# EAGLE design rng_rava (EAGLE 9.6.2)
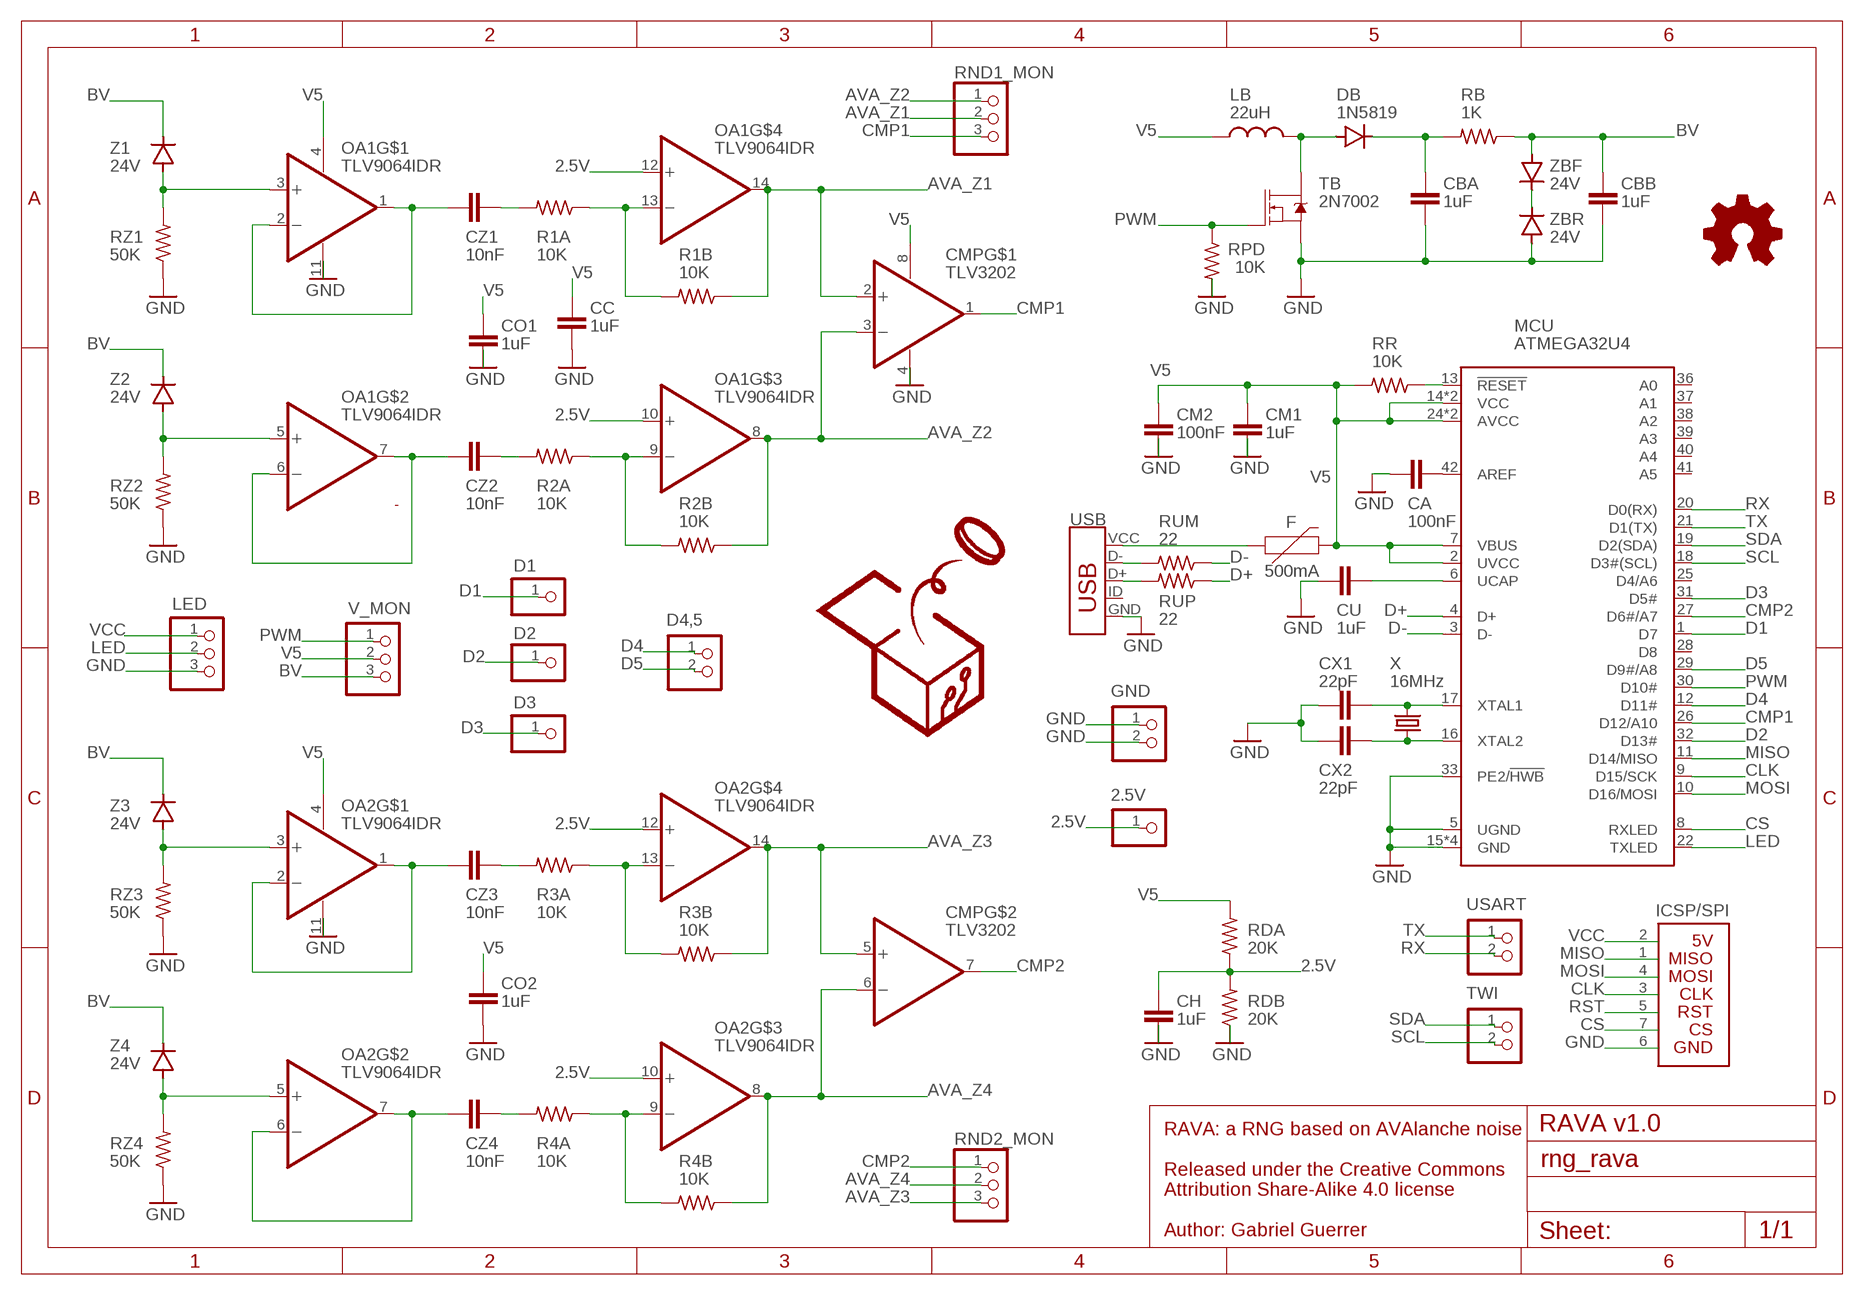
[diagram p0: schematic, sheet 1]

## Parts
2.5V  PINHD-1X1LARGE  [1X01LARGE]
CA  100nF  C_0805  [0805]
CBA  1uF  C_0805  [0805]
CBB  1uF  C_0805  [0805]
CC  1uF  C_0805  [0805]
CH  1uF  C_0805  [0805]
CM1  1uF  C_0805  [0805]
CM2  100nF  C_0805  [0805]
CMP  TLV3202  [SOIC8]
CO1  1uF  C_0805  [0805]
CO2  1uF  C_0805  [0805]
CU  1uF  C_0805  [0805]
CX1  22pF  C_0805  [0805]
CX2  22pF  C_0805  [0805]
CZ1  10nF  C_0805  [0805]
CZ2  10nF  C_0805  [0805]
CZ3  10nF  C_0805  [0805]
CZ4  10nF  C_0805  [0805]
D1  PINHD-1X1LARGE  [1X01LARGE]
D2  PINHD-1X1LARGE  [1X01LARGE]
D3  PINHD-1X1LARGE  [1X01LARGE]
D4,5  PINHD-1X2  [1X02]
DB  1N5819  DIODESOD-323  [SOD-323]
F  500mA  PPTC_6V500MA  [0805]
GND  PINHD-1X2  [1X02]
ICSP/SPI  ICSP-CS  [2X04]
LB  22uH  L_0805  [0805]
LED  PINHD-1X3  [1X03]
MCU  ATMEGA32U4  ATMEGA32U4-ARDUINOTQFP-44  [TQFP44]
OA1  TLV9064IDR  [SOIC127P600X175-14N]
OA2  TLV9064IDR  [SOIC127P600X175-14N]
R1A  10K  R_0805  [0805]
R1B  10K  R_0805  [0805]
R2A  10K  R_0805  [0805]
R2B  10K  R_0805  [0805]
R3A  10K  R_0805  [0805]
R3B  10K  R_0805  [0805]
R4A  10K  R_0805  [0805]
R4B  10K  R_0805  [0805]
RB  1K  R_0805  [0805]
RDA  20K  R_0805  [0805]
RDB  20K  R_0805  [0805]
RND1_MON  PINHD-1X3  [1X03]
RND2_MON  PINHD-1X3  [1X03]
RPD  10K  R_0805  [0805]
RR  10K  R_0805  [0805]
RUM  22  R_0805  [0805]
RUP  22  R_0805  [0805]
RZ1  50K  R_0805  [0805]
RZ2  50K  R_0805  [0805]
RZ3  50K  R_0805  [0805]
RZ4  50K  R_0805  [0805]
TB  2N7002  MOSFET-NCH-2N7002PW  [SOT323]
TWI  PINHD-1X2  [1X02]
USART  PINHD-1X2  [1X02]
USB  C40957  USB-MICROB-C40957U254-051N-4BH806  [U254-051N-4BH806]
V_MON  PINHD-1X3  [1X03]
X  16MHz  CRYSTAL_5032  [SMD_5032]
Z1  24V  DIODESOD-323  [SOD-323]
Z2  24V  DIODESOD-323  [SOD-323]
Z3  24V  DIODESOD-323  [SOD-323]
Z4  24V  DIODESOD-323  [SOD-323]
ZBF  24V  DIODESOD-323  [SOD-323]
ZBR  24V  DIODESOD-323  [SOD-323]

## Nets
2.5V: 2.5V.1 CH.2 OA1.10(+IN) OA1.12(+IN) OA2.10(+IN) OA2.12(+IN) RDA.1 RDB.2
AVA_Z1: CMP.2(+IN) OA1.14(OUT) R1B.1 RND1_MON.2
AVA_Z2: CMP.3(-IN) OA1.8(OUT) R2B.1 RND1_MON.1
AVA_Z3: CMP.5(+IN) OA2.14(OUT) R3B.1 RND2_MON.3
AVA_Z4: CMP.6(-IN) OA2.8(OUT) R4B.1 RND2_MON.2
BV: CBB.1 RB.1 V_MON.3 Z1.C Z2.C Z3.C Z4.C ZBF.A
CLK: ICSP/SPI.3(CLK) MCU.9(D15/SCK)
CMP1: CMP.1(OUT) MCU.26(D12/A10) RND1_MON.3
CMP2: CMP.7(OUT) MCU.27(D6#/A7) RND2_MON.1
CS: ICSP/SPI.7(CS) MCU.8(RXLED)
D1: D1.1 MCU.1(D7)
D2: D2.1 MCU.32(D13#)
D3: D3.1 MCU.31(D5#)
D4: D4,5.1 MCU.12(D11#)
D5: D4,5.2 MCU.29(D9#/A8)
D+: MCU.4(D+) RUP.1
D-: MCU.3(D-) RUM.1
GND: CA.1 CBA.2 CBB.2 CC.2 CH.1 CM1.1 CM2.1 CMP.4(GND) CO1.2 CO2.2 CU.1 CX1.2 CX2.2 GND.1 GND.2 ICSP/SPI.6(GND) LED.3 MCU.5(UGND) MCU.15(GND) MCU.23(GND) MCU.33(PE2/!HWB) MCU.35(GND) MCU.43(GND) OA1.11(GND) OA2.11(GND) RDB.1 RPD.2 RZ1.1 RZ2.1 RZ3.1 RZ4.1 TB.2(S) USB.GND ZBR.A
LED: LED.2 MCU.22(TXLED)
MISO: ICSP/SPI.1(MISO) MCU.11(D14/MISO)
MOSI: ICSP/SPI.4(MOSI) MCU.10(D16/MOSI)
N$1: CZ1.2 R1A.2
N$2: CZ1.1 OA1.1(OUT) OA1.2(-IN)
N$3: OA1.3(+IN) RZ1.2 Z1.A
N$4: OA1.13(-IN) R1A.1 R1B.2
N$5: CZ2.1 OA1.6(-IN) OA1.7(OUT)
N$6: OA1.5(+IN) RZ2.2 Z2.A
N$7: CZ2.2 R2A.2
N$8: OA1.9(-IN) R2A.1 R2B.2
N$9: CZ3.1 OA2.1(OUT) OA2.2(-IN)
N$10: OA2.3(+IN) RZ3.2 Z3.A
N$11: CZ3.2 R3A.2
N$12: OA2.13(-IN) R3A.1 R3B.2
N$13: CZ4.1 OA2.6(-IN) OA2.7(OUT)
N$14: OA2.5(+IN) RZ4.2 Z4.A
N$15: CZ4.2 R4A.2
N$16: OA2.9(-IN) R4A.1 R4B.2
N$17: DB.A LB.2 TB.3(D)
N$18: CBA.1 DB.C RB.2
N$19: ZBF.C ZBR.C
N$20: CU.2 MCU.6(UCAP)
N$21: RUM.2 USB.D-
N$22: RUP.2 USB.D+
N$23: CX1.1 MCU.17(XTAL1) X.P$2
N$24: CX2.1 MCU.16(XTAL2) X.P$1
N$25: CA.2 MCU.42(AREF)
PWM: MCU.30(D10#) RPD.1 TB.1(G) V_MON.1
RST: ICSP/SPI.5(RST) MCU.13(!RESET) RR.1
RX: MCU.20(D0(RX)) USART.2
SCL: MCU.18(D3#(SCL)) TWI.2
SDA: MCU.19(D2(SDA)) TWI.1
TX: MCU.21(D1(TX)) USART.1
V5: CC.1 CM1.2 CM2.2 CMP.8(VCC) CO1.1 CO2.1 F.2 LB.1 MCU.2(UVCC) MCU.7(VBUS) MCU.14(VCC) MCU.24(AVCC) MCU.34(VCC) MCU.44(AVCC) OA1.4(VCC) OA2.4(VCC) RDA.2 RR.2 V_MON.2
VCC: F.1 ICSP/SPI.2(VCC_3V) LED.1 USB.VCC(VBUS)
Unconnected: MCU.25(D4/A6) MCU.28(D8) MCU.36(A0) MCU.37(A1) MCU.38(A2) MCU.39(A3) MCU.40(A4) MCU.41(A5) USB.ID

## Notes on the sheet
- RAVA v1.0
- RAVA: a RNG based on AVAlanche noise
  
  Released under the Creative Commons
  Attribution Share-Alike 4.0 license
  
  Author: Gabriel Guerrer

## Library data of the parts
2.5V D1-D3 = pinhead:PINHD-1X1LARGE: PIN HEADER
CA CBA CBB CC CH CM1 CM2 CO1 CO2 CU = MY_LIB:C_0805; LCSC_PART: C28323
CMP = MY_LIB:TLV3202; LCSC_PART: C129325
CX1 CX2 = MY_LIB:C_0805; LCSC_PART: C1804
CZ1-CZ4 = MY_LIB:C_0805; LCSC_PART: C1710
D4,5 GND TWI USART = pinhead:PINHD-1X2: PIN HEADER
DB = MY_LIB:DIODE; LCSC_PART: C369937
F = SparkFun-Fuses:PPTC: Resettable Fuse PPTC Resettable Fuse. Really a sort of resistor with a polymeric positive temperature coefficient whose resistance increases dramatically with an increase in temperature. When heated by the power passing through the resistance rises causing the current to be limited, protecting the circuit. This is achieved by the transition of the polymer from a crystalline to an amorphous state where the conductive carbon separates breaking the conductive pathways found in the cool crystalline structure. When a PPTC cools back down it resumes conducting letting the circuit turn back on. SparkFun Products: SparkFun RedBoard - Programmed with Arduino <https://www.sparkfun.com/products/12757> Pro Micro - 5V/16MHz <https://www.sparkfun.com/products/12640> Arduino Pro 328 - 5V/16MHz <https://www.sparkfun.com/products/10915> MP3 Trigger <https://www.sparkfun.com/products/13720>; PROD_ID: RES-13945; VALUE: 6V 0.5A
ICSP/SPI = MY_LIB:ICSP-CS
LB = MY_LIB:L_0805; LCSC_PART: C223170
LED RND1_MON RND2_MON V_MON = pinhead:PINHD-1X3: PIN HEADER
MCU = SparkFun-IC-Microcontroller:ATMEGA32U4-ARDUINO: Atmel MCU, 32KByte Atmel 44-pin 8-bit Microcontroller with 32KBytes of ISP Flash and USB Controller Datasheet <http://cdn.sparkfun.com/datasheets/Dev/Arduino/Boards/ATMega32U4.pdf> SparkFun Products LilyPad Arduino USB - ATmega32U4 Board <https://www.sparkfun.com/products/12049> (DEV-12049) Pro Micro - 5V/16MHz <https://www.sparkfun.com/products/12640> (DEV-12640) Pro Micro - 3.3V/8MHz <https://www.sparkfun.com/products/12587> (DEV-12587) Fio v3 - ATmega32U4 <https://www.sparkfun.com/products/11520> (DEV-11520) Qduino Mini <https://www.sparkfun.com/products/13614> (DEV-13614) Makey Makey - Standard Kit <https://www.sparkfun.com/products/11511> (WIG-11511) Makey Makey Deluxe Kit <https://www.sparkfun.com/products/11519> (WIG-11519); LCSC_PART: C44854; PROD_ID: IC-11161; VALUE: 32U4
OA1 OA2 = MY_LIB:TLV9064IDR: None; AVAILABILITY: Unavailable; DESCRIPTION: CMOS Amplifier 4 Circuit Rail-to-Rail 14-SOIC; LCSC_PART: C388176; MF: Texas Instruments; MP: TLV9064IDR; PACKAGE: SOIC-14 Texas Instruments; PRICE: None
R1A R1B R2A R2B R3A R3B R4A R4B RR = MY_LIB:R_0805; LCSC_PART: C276215
RB RPD = MY_LIB:R_0805; LCSC_PART: C317261
RDA RDB = MY_LIB:R_0805; LCSC_PART: C4328
RUM RUP = MY_LIB:R_0805; LCSC_PART: C17561
RZ1-RZ4 = MY_LIB:R_0805; LCSC_PART: C276216
TB = SparkFun-DiscreteSemi:MOSFET-NCH: N-channel MOSFETs Voltage controlled devices that allow control of high current outputs. SparkFun Products: SparkFun OpenScale <https://www.sparkfun.com/products/13261> SparkFun Digital Sandbox <https://www.sparkfun.com/products/12651> SparkFun Monster Moto Shield <https://www.sparkfun.com/products/10182> SparkFun MOSFET Power Controller <https://www.sparkfun.com/products/11214>; LCSC_PART: C139444; PROD_ID: TRANS-11151; VALUE: 310mA/60V/1.6Ω
USB = MY_LIB:USB-MICROB-C40957; LCSC_PART: C319170
X = MY_LIB:CRYSTAL_5032; LCSC_PART: C115962
Z1-Z4 ZBF ZBR = MY_LIB:DIODE; LCSC_PART: C118615

## Net classes
0 default: width 0.203 mm

## Board
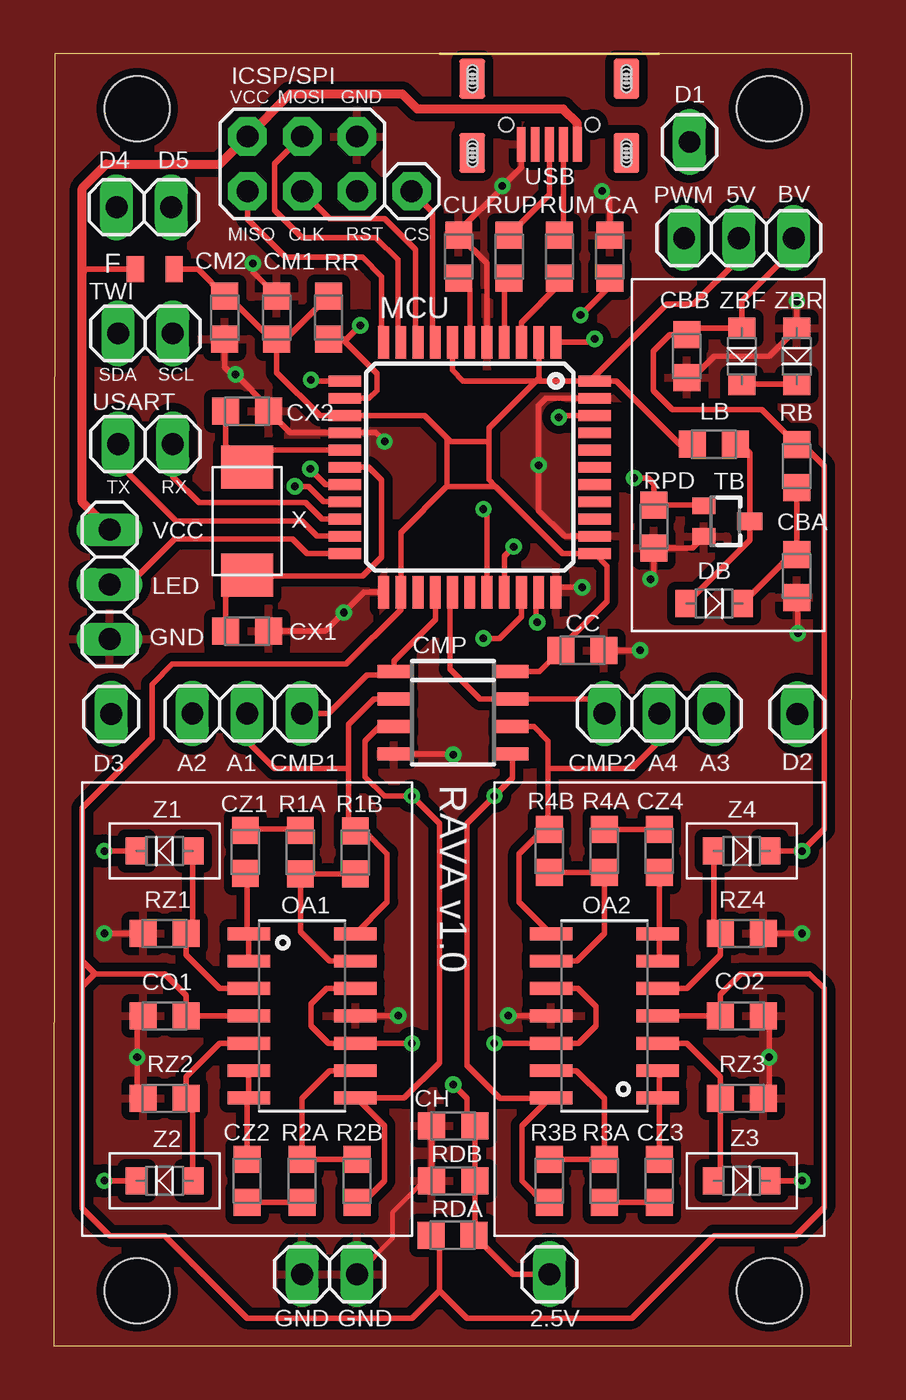
[diagram p1: board, top side]
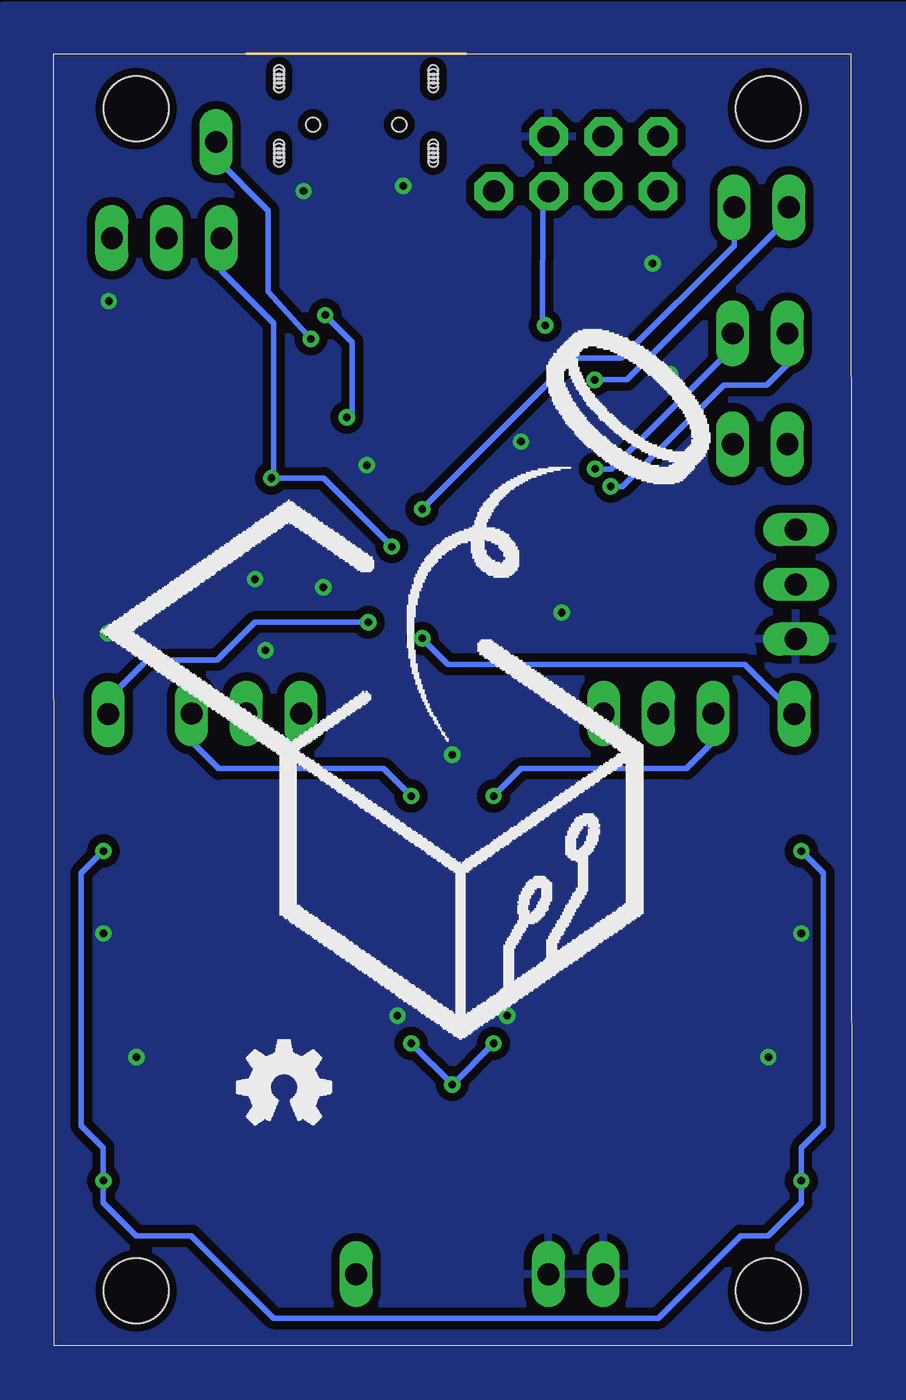
[diagram p2: board, bottom side, seen from below]

Size 37.02 x 59.92 mm. Coordinates in mm from the lower left corner, seen from the top.
Outline: 0,0 37.01,0 37.02,59.92 0.04,59.92 0,0
Copper layers (1*16): Top 0.035mm / dielectric 1.5mm / Bottom 0.035mm
Design rules "default *": minimum track width 6mil, minimum drill 0.35mm, track to track 6mil, track to pad 6mil, pad to pad 6mil, via to via 6mil, smd to smd 6mil, copper to edge 0mil, drill to drill 6mil, minimum pad ring 10mil, minimum via ring 8mil, stop-mask expansion 4mil, vias tented up to drill 0mil, thermal gap 15mil
Holes 3 mm at 3.87,2.54 33.19,57.37 3.87,57.37 33.19,2.54

### Footprints (pad centres in the part's own frame; a part is rotated, then mirrored left to right if it is on the bottom)
1X01LARGE = drill 1.016 long: 1 -1.27,0
0805 = smd 1.25 x 1.25: 1 -1,0; 2 1,0
SOIC8 = smd 0.6 x 1.5: 1 -1.905,-2.75; 2 -0.635,-2.75; 3 0.635,-2.75; 4 1.905,-2.75; 5 1.905,2.75; 6 0.635,2.75; 7 -0.635,2.75; 8 -1.905,2.75
1X02 = drill 1.016 long: 1 -1.27,0; 2 1.27,0
SOD-323 = smd 1 x 1.25: A -1.3,0; C 1.3,0
0805' = smd 0.8 x 1.2: 1 -0.9,0; 2 0.9,0
2X04 = drill 1.016 pad 1.778 octagon: 1 -3.81,-1.27; 2 -3.81,1.27; 3 -1.27,-1.27; 4 -1.27,1.27; 5 1.27,-1.27; 6 1.27,1.27; 7 3.81,-1.27
1X03 = drill 1.016 long: 1 -2.54,0; 2 0,0; 3 2.54,0
TQFP44 = smd 1.5 x 0.5: 1 -5.8,4; 2 -5.8,3.2; 3 -5.8,2.4; 4 -5.8,1.6; 5 -5.8,0.8; 6 -5.8,0; 7 -5.8,-0.8; 8 -5.8,-1.6; 9 -5.8,-2.4; 10 -5.8,-3.2; 11 -5.8,-4; 23 5.8,-4; 24 5.8,-3.2; 25 5.8,-2.4; 26 5.8,-1.6; 27 5.8,-0.8; 28 5.8,0; 29 5.8,0.8; 30 5.8,1.6; 31 5.8,2.4; 32 5.8,3.2; 33 5.8,4 | smd 0.5 x 1.5: 12 -4,-5.8; 13 -3.2,-5.8; 14 -2.4,-5.8; 15 -1.6,-5.8; 16 -0.8,-5.8; 17 0,-5.8; 18 0.8,-5.8; 19 1.6,-5.8; 20 2.4,-5.8; 21 3.2,-5.8; 22 4,-5.8; 34 4,5.8; 35 3.2,5.8; 36 2.4,5.8; 37 1.6,5.8; 38 0.8,5.8; 39 0,5.8; 40 -0.8,5.8; 41 -1.6,5.8; 42 -2.4,5.8; 43 -3.2,5.8; 44 -4,5.8
SOIC127P600X175-14N = smd 1.97 x 0.6: 1 -2.475,3.81; 2 -2.475,2.54; 3 -2.475,1.27; 4 -2.475,0; 5 -2.475,-1.27; 6 -2.475,-2.54; 7 -2.475,-3.81; 8 2.475,-3.81; 9 2.475,-2.54; 10 2.475,-1.27; 11 2.475,0; 12 2.475,1.27; 13 2.475,2.54; 14 2.475,3.81
SOT323 = smd 0.762 x 1.067: 1 -0.711,-0.991; 2 0.711,-0.991 | smd 0.813 x 1.143: 3 0,1.143
U254-051N-4BH806 = smd 1.2 x 1.85: BASE1 3.575,1.15; BASE2 -3.575,1.15; BASE3 -3.575,4.6; BASE4 3.575,4.6 | smd 0.4 x 1.6: D+ 0,4.2; D- -0.65,4.2; GND 1.3,4.2; ID 0.65,4.2; VCC -1.3,4.2 | hole 0.65: 2,3.28; -2,3.28 | hole 0.45: 3.575,1.15; 3.575,1.55; 3.575,0.75; 3.575,1.35; 3.575,0.95; -3.575,1.55; -3.575,1.35; -3.575,1.15; -3.575,0.95; -3.575,0.75; 3.575,4.6; 3.575,4.2; 3.575,4.4; 3.575,4.8; 3.575,5; -3.575,4.2; -3.575,4.4; -3.575,4.6; -3.575,4.8; -3.575,5
SMD_5032 = smd 2 x 2.4: P$1 2.5,0; P$2 -2.5,0

### Placement (x,y rotation side)
2.5V  24.27,3.31 0 top
CA  25.79,50.52 270 top
CBA  34.46,35.7 270 top
CBB  29.37,45.9 270 top
CC  24.52,32.25 0 top
CH  18.53,10.2 0 top
CM1  10.34,47.69 270 top
CM2  7.93,47.69 90 top
CMP  18.52,29.35 270 top
CO1  5.14,15.29 180 top
CO2  31.91,15.29 0 top
CU  18.78,50.52 270 top
CX1  8.96,33.15 0 top
CX2  8.96,43.34 0 top
CZ1  8.88,22.9 90 top
CZ2  8.96,7.64 270 top
CZ3  28.09,7.64 270 top
CZ4  28.09,22.95 90 top
D1  30.77,55.84 0 top
D2  35.77,29.3 0 top
D3  3.93,29.3 0 top
D4,5  4.18,52.8 0 top
DB  30.64,34.42 0 top
F  500mA  [0805']  4.68,49.93 0 top
GND  12.79,3.31 0 top
ICSP/SPI  12.79,54.82 0 top
LB  30.62,41.82 0 top
LED  2.58,35.31 270 top
MCU  19.29,40.74 270 top
OA1  11.52,15.29 0 top
OA2  25.54,15.29 180 top
R1A  11.43,22.89 90 top
R1B  13.98,22.88 270 top
R2A  11.52,7.64 270 top
R2B  14.07,7.64 90 top
R3A  25.54,7.64 270 top
R3B  22.99,7.64 90 top
R4A  25.54,22.95 90 top
R4B  22.99,22.95 270 top
RB  34.46,40.8 270 top
RDA  18.5,5.12 180 top
RDB  18.53,7.64 0 top
RND1_MON  8.96,29.32 0 top
RND2_MON  28.09,29.32 0 top
RPD  27.84,37.99 270 top
RR  12.75,47.69 90 top
RUM  23.46,50.52 90 top
RUP  21.12,50.52 90 top
RZ1  5.14,19.12 0 top
RZ2  5.14,11.47 0 top
RZ3  31.91,11.47 180 top
RZ4  31.91,19.12 180 top
TB  31.15,38.24 270 top
TWI  4.25,46.96 0 top
USART  4.25,41.82 0 top
USB  22.99,59.92 180 top
V_MON  31.78,51.38 0 top
X  8.96,38.24 90 top
Z1  5.14,22.95 180 top
Z2  5.14,7.64 180 top
Z3  31.91,7.64 0 top
Z4  31.91,22.95 0 top
ZBF  31.91,45.9 270 top
ZBR  34.46,45.9 270 top

### Tracks (layer width: path | path; a pad name or v marks a point on that pad's centre or on a via)
2.5V  (via drill 0.35)
  Top 0.254: OA1.10 | OA1.10 12.75,14.02 11.94,14.84 11.94,15.86 12.65,16.57 OA1.12 | v16.61,14.02 OA1.10 | OA2.12 | OA2.12 v20.44,14.02 | v18.53,12.11 19.16,11.47 19.16,10.56 CH.2 RDB.2 19.53,5.16 RDA.1 21.31,3.31 2.5V.1 | OA2.10 24.31,16.57 25.15,15.73 25.15,14.84 24.33,14.02 OA2.12
  Bottom 0.254: v16.61,14.02 v18.53,12.11 v20.44,14.02
AVA_Z1
  Top 0.254: OA1.14 15.47,20.58 15.47,22.82 14.41,23.88 R1B.1 13.68,24.19 13.68,24.55 13.68,26.8 | RND1_MON.2 8.96,28.05 10.24,26.77 13.64,26.77 13.68,26.8 | CMP.2 14.86,29.99 13.68,28.8 13.68,26.8
AVA_Z2  (via drill 0.35)
  Top 0.254: R2B.1 14.21,6.52 15.34,7.64 15.34,10.2 14.05,11.48 | 14.05,11.48 OA1.8 | 15.12,28.72 15.07,28.67 | 15.07,28.67 14.45,28.05 14.45,26.39 15.34,25.5 v16.61,25.5 17.89,24.22 17.89,13.13 16.25,11.48 14.05,11.48 | CMP.3 15.72,28.67 15.07,28.67
  Bottom 0.254: v16.61,25.5 15.34,26.77 7.68,26.77 6.42,28.03 RND1_MON.1
AVA_Z3  (via drill 0.35)
  Top 0.254: R3B.1 22.84,6.52 21.71,7.64 21.71,10.2 23,11.48 OA2.14 23.05,11.47 22.68,11.47 20.69,11.47 19.16,13 19.16,24.22 v20.44,25.5 21.27,26.33 CMP.5
  Bottom 0.254: v20.44,25.5 21.71,26.77 29.37,26.77 30.63,28.04 RND2_MON.3
AVA_Z4
  Top 0.254: OA2.8 21.59,20.58 21.59,22.82 22.71,23.95 R4B.1 22.93,24 22.93,26.8 | RND2_MON.2 28.09,28.05 26.81,26.77 22.96,26.77 22.93,26.8 | 22.93,26.8 22.93,28.05 22.27,28.72 CMP.6
BV  (via drill 0.35)
  Top 0.254: V_MON.3 34.32,50.85 31.91,48.45 ZBF.A 29.66,47.2 CBB.1 28.58,46.9 27.81,46.13 27.81,44.3 28.7,43.41 32.85,43.41 RB.1 34.74,41.8 35.74,40.8 35.74,23.97 v34.72,22.95 33.24,22.95 33.21,22.97 Z4.C | Z1.C v2.34,22.95 | v2.34,7.64 Z2.C | v34.72,7.64 Z3.C
  Bottom 0.254: v34.72,22.95 35.74,21.92 35.74,10.2 34.72,9.18 v34.72,7.64 34.72,6.62 33.19,5.09 30.64,5.09 26.81,1.27 8.96,1.27 6.57,3.66 6.57,3.67 5.14,5.09 3.87,5.09 2.34,6.62 v2.34,7.64 2.34,9.17 1.31,10.2 1.31,21.92 v2.34,22.95
CLK
  Top 0.254: MCU.9 16.77,46.67 16.77,50.84 15.34,52.27 12.79,52.27 ICSP/SPI.3
CMP1
  Top 0.254: RND1_MON.3 12.75,29.32 14.54,31.1 15.62,31.1 CMP.1 15.77,31.76 17.7,33.68 MCU.26
CMP2
  Top 0.254: RND2_MON.1 24.88,29.98 24.88,29.99 CMP.7 19.77,29.99 18.37,31.39 18.37,34.82 MCU.27
CS
  Top 0.254: MCU.8 17.57,46.67 17.57,52.58 ICSP/SPI.7
D1  (via drill 0.35)
  Top 0.254: MCU.1 24.94,46.55 v25.09,46.7
  Bottom 0.254: v25.09,46.7 27.07,48.89 27.07,52.65 29.5,55.07 D1.1
D2  (via drill 0.35)
  Top 0.254: v22.43,33.55 22.37,33.62 22.37,34.82 MCU.32
  Bottom 0.254: v22.43,33.55 27.68,33.55 29.43,31.8 32.68,31.8 34.5,29.99 D2.1
D3  (via drill 0.35)
  Top 0.254: MCU.31 21.7,33.82 20.68,32.8 v19.93,32.8
  Bottom 0.254: D3.1 4.96,31.6 18.73,31.6 v19.93,32.8
D4  (via drill 0.35)
  Top 0.254: MCU.12 11.99,44.74 v11.93,44.8
  Bottom 0.254: v11.93,44.8 10.43,44.8 2.91,52.33 D4,5.1
D5  (via drill 0.35)
  Top 0.254: MCU.29 20.09,38.64 v19.93,38.8
  Bottom 0.254: D4,5.2 5.45,51.03 10.68,45.8 12.93,45.8 v19.93,38.8
D+
  Top 0.254: MCU.4 20.89,49.74 RUP.1
D-
  Top 0.254: MCU.3 21.7,47.46 23.46,49.23 RUM.1
GND  (via drill 0.35)
  Top 0.203: RDB.1 17.36,7.47 17.02,7.47 15.72,6.18 15.72,4.97 GND.2
  Top 0.254: v15.98,15.3 15.27,15.3 15.27,15.29 OA1.11 | OA2.11 21.79,15.29 21.79,15.3 v21.07,15.3 | v18.52,27.41 18.48,27.45 CMP.4 | v27.2,32.25 CC.2 | MCU.43 22.84,43.95 22.49,43.6 v22.49,40.84 22.49,38.74 23.69,37.55 MCU.35 25.11,37.53 | MCU.33 23.53,35.18 v24.52,35.18 | RZ1.1 v2.34,19.12 | v34.72,19.12 RZ4.1 | CX1.2 12.59,33.15 v13.45,34.01 14.39,34.95 MCU.23 | v15.34,41.94 14.94,42.34 MCU.15 10.96,42.34 CX2.2 | 9.96,42.96 CX2.2 | 18.66,51.52 CU.1 | CBB.2 29.64,44.9 30.64,45.9 33.19,45.9 34.46,47.17 ZBR.A v34.46,48.45 v34.47,48.45 | CH.1 RDB.1 17.53,7.29 | RZ2.1 3.87,11.75 v3.87,13.38 3.87,15.02 CO1.2 | RZ3.1 33.19,11.75 v33.19,13.38 33.19,15.02 CO2.2 | CM1.1 9.24,49.79 v9.23,50.21 | USB.GND 21.69,54.67 v20.81,53.79 20.81,53.72 18.78,51.69 CU.1 | MCU.5 20.09,50.21 CU.1 | CBA.2 34.52,34.64 v34.52,33.04 | TB.2 29.62,36.99 RPD.2 27.84,35.71 v27.68,35.55 | CA.1 25.8,53.19 v25.43,53.55 | CM2.1 7.93,45.38 8.25,45.05 v8.43,45.05 9.96,43.52 CX2.2
  pour Bottom (isolate 0.381): -2.55,62.16 -2.55,-2.55 39.38,-2.55 39.38,62.16
  pour Top (isolate 0.381): -5.06,-5.11 42.12,-5.11 42.12,63.74 -5.06,63.74
LED
  Top 0.254: LED.2 3.48,35.31 5.59,37.42 11.07,37.42 11.74,36.74 MCU.22
MISO
  Top 0.254: MCU.11 15.21,46.63 15.21,49.6 14.32,50.49 10.74,50.49 8.98,52.26 ICSP/SPI.1
MOSI
  Top 0.254: MCU.10 15.97,46.67 15.97,50.37 14.93,51.41 11.51,51.41 10.24,52.68 10.24,54.82 ICSP/SPI.4
N$1
  Top 0.254: R1A.2 11.36,23.97 8.95,23.97 CZ1.2
N$2
  Top 0.254: CZ1.1 8.96,21.87 8.96,19.12 8.98,19.11 OA1.1 OA1.2
N$3
  Top 0.254: OA1.3 7.7,16.57 6.14,18.12 RZ1.2 6.44,19.42 Z1.A
N$4
  Top 0.254: OA1.13 12.8,17.84 11.43,19.2 R1A.1 11.45,21.88 R1B.2
N$5
  Top 0.254: CZ2.1 8.96,11.41 OA1.7 OA1.6
N$6
  Top 0.254: OA1.5 7.69,14.02 6.14,12.47 RZ2.2 6.44,11.17 Z2.A
N$7
  Top 0.254: CZ2.2 R2A.2
N$8
  Top 0.254: R2B.2 R2A.1 11.52,11.47 12.8,12.75 OA1.9
N$9
  Top 0.254: OA2.2 28.09,12.68 28.09,11.47 | 28.09,11.47 28.03,11.47 OA2.1 | CZ3.1 28.09,11.47
N$10
  Top 0.254: OA2.3 29.36,14.02 30.91,12.47 RZ3.2 30.91,7.95 Z3.A
N$11
  Top 0.254: CZ3.2 R3A.2
N$12
  Top 0.254: R3B.2 R3A.1 25.54,11.47 24.25,12.75 OA2.13
N$13
  Top 0.254: OA2.7 28.09,19.18 | 28.09,19.18 CZ4.1 | OA2.6 28.09,17.91 28.09,19.18
N$14
  Top 0.254: OA2.5 29.37,16.57 30.91,18.12 RZ4.2 30.62,19.42 Z4.A
N$15
  Top 0.254: CZ4.2 R4A.2
N$16
  Top 0.254: R4B.2 R4A.1 25.54,19.12 24.27,17.84 23.07,17.84 OA2.9
N$17
  Top 0.254: DB.A 32.29,37.38 TB.3 32.29,41.39 31.87,41.82 LB.2
N$18
  Top 0.254: RB.2 CBA.1 34.21,36.7 DB.C
N$19
  Top 0.254: ZBR.C ZBF.C
N$20
  Top 0.254: CU.2 19.29,49.01 MCU.6
N$21
  Top 0.254: RUM.2 23.64,51.7 USB.D-
N$22
  Top 0.254: RUP.2 22.99,53.39 USB.D+
N$23
  Top 0.254: CX1.1 7.96,34.74 X.P$2 9.02,35.7 14.32,35.7 15.21,36.59 15.21,40.14 14.61,40.74 MCU.17
N$24
  Top 0.254: CX2.1 7.96,41.74 X.P$1 9.77,41.55 MCU.16
N$25  (via drill 0.35)
  Top 0.254: v24.43,47.8 24.46,47.8 25.8,49.14 CA.2 | v23.43,43.05 23.52,43.15 MCU.42
  Bottom 0.254: v24.43,47.8 23.18,46.55 23.18,43.3 v23.43,43.05
PWM  (via drill 0.35)
  Top 0.254: 26.94,40.23 v26.92,40.24 27.56,40.24 27.84,39.97 RPD.1 30.12,38.99 TB.1 | 21.35,37.05 v21.34,37.06 20.89,36.62 MCU.30
  Bottom 0.254: v21.34,37.06 v21.34,37.07 24.51,40.24 v26.92,40.24 26.82,40.35 26.82,47.42 29.24,49.85 V_MON.1
RST  (via drill 0.35)
  Top 0.254: MCU.13 14.63,43.95 14.99,44.3 14.99,45.09 13.39,46.69 RR.1 13.58,46.69 v14.22,47.33
  Bottom 0.254: ICSP/SPI.5 14.33,53.28 14.35,47.46 v14.22,47.33
RX
  Top 0.254: MCU.20 12.43,38.34 11.68,39.1 6.73,39.1 5.52,40.31 USART.2
SCL  (via drill 0.35)
  Top 0.254: MCU.18 12.61,39.95 v11.9,40.66 v11.9,40.67
  Bottom 0.254: v11.9,40.67 11.15,40.67 5.52,46.3 TWI.2
SDA  (via drill 0.35)
  Top 0.254: MCU.19 12.52,39.15 11.81,39.86 v11.18,39.86
  Bottom 0.254: v11.18,39.86 10.88,39.86 | 10.88,39.86 10.63,39.86 5.93,44.55 3.93,44.55 2.98,45.51 TWI.1 | 10.88,39.86
TX
  Top 0.254: MCU.21 12.21,37.55 11.52,38.24 5.68,38.24 2.98,40.95 USART.1
V5
  Top 0.254: LB.1 29.02,41.82 26.09,44.74 MCU.44 24.93,44.74 | 1.31,17.84 1.31,24.94 4.55,28.18 4.55,30.68 5.49,31.62 13.57,31.62 16.09,34.15 MCU.24 16.09,37.73 18.23,39.86 | 1.31,17.84 1.31,16.66 | 1.31,16.66 1.31,6.37 2.59,5.09 5.14,5.09 8.96,1.27 16.61,1.27 17.89,2.54 | 17.89,2.54 17.89,4.73 RDA.2 | 17.89,2.54 19.16,1.27 26.81,1.27 30.64,5.09 34.42,5.09 35.74,6.42 35.74,16.57 35.06,17.25 31.88,17.25 30.91,16.29 CO2.1 OA2.4 | OA1.4 CO1.1 6.14,16.25 5.14,17.25 1.9,17.25 | 1.31,17.84 1.9,17.25 | 1.9,17.25 1.31,16.66 | 20.48,39.86 23.6,36.74 MCU.34 25.67,36.17 25.67,34.53 23.52,32.38 CC.1 22.53,31.26 CMP.8 | 18.23,42.11 17.2,43.15 MCU.14 12.34,43.15 10.34,45.15 CM1.2 | 12.75,48.29 RR.2 10.75,46.69 CM1.2 | 10.34,46.24 CM1.2 | CM1.2 10.29,46.69 | V_MON.2 31.78,50.41 29.68,48.3 28.43,48.3 24.93,44.8 24.93,44.74 | MCU.7 18.5,45.24 18.99,44.74 22.62,44.74 | 18.23,42.11 18.23,39.86 | 18.23,39.86 18.24,39.86 20.48,39.86 | 20.48,39.86 20.18,40.16 20.18,42.56 22.5,44.88 | 20.05,41.93 18.41,41.93 18.23,42.11 | 7.43,49.19 CM2.2 | CM2.2 8.09,48.69 10.09,46.69 CM1.2 | MCU.2 22.5,44.88 | 22.5,44.88 22.62,44.74 | 22.62,44.74 24.93,44.74 | F.2 6.69,49.93 CM2.2
VCC
  Top 0.254: F.1 1.44,49.93 1.31,49.8
  Top 0.406: LED.1 1.31,39.12 1.31,49.8 1.31,53.69 2.43,54.8 7.7,54.8 ICSP/SPI.2 10.95,58.05 16.17,58.05 16.86,57.36 23.62,57.36 24.29,56.7 USB.VCC

### Text on the board
tPlace: D4 | D5 | PWM | 5V | BV | F | VCC | GND | A2 | A1 | CMP1 | CMP2 | A4 | A3 | RAVA v1.0 | GND | GND | 2.5V
tNames: VCC | SDA | SCL | TX | RX
tDocu: RAVA: a RNG based on AVAlanche noise / / Released under the Creative Commons / Attribution Share-Alike 4.0 license / / Author: Gabriel Guerrer